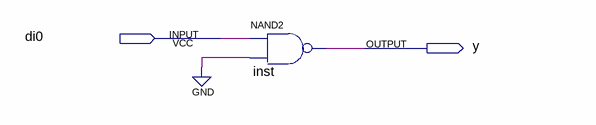
[diagram p0: schematic sheet]
// Quartus schematic NAND_Instruct.bdf as structural Verilog: 1 symbols, 2 pins
module NAND_Instruct (
  input  di0,
  output y
);

  nand inst (y, di0, 1'b0);
endmodule
